# EAGLE design pic32 (EAGLE 7.5.0)
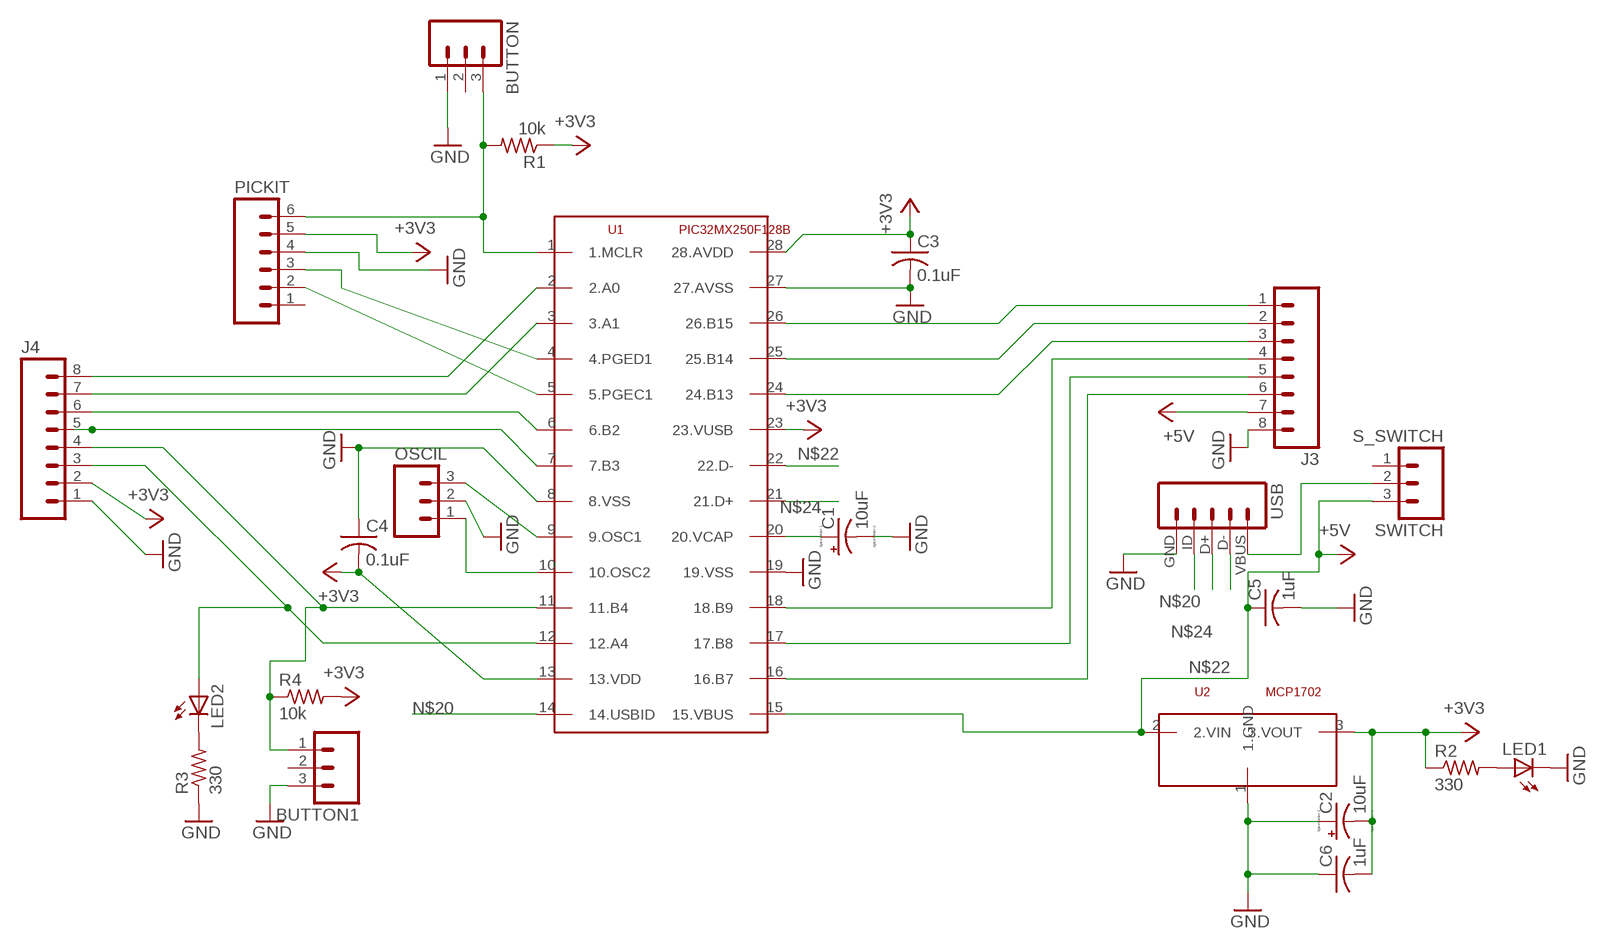
[diagram p0: schematic, sheet 1]

## Parts
BUTTON  M03PTH  [1X03]
BUTTON1  M03PTH  [1X03]
C1  10uF  CPOL-USTT2D4  [TT2D4]
C2  10uF  CPOL-USTT2D4  [TT2D4]
C3  0.1uF  C-US025-024X044  [C025-024X044]
C4  0.1uF  C-US025-024X044  [C025-024X044]
C5  1uF  C-US025-024X044  [C025-024X044]
C6  1uF  C-US025-024X044  [C025-024X044]
J3  M08  [1X08_ROUND]
J4  M08  [1X08_ROUND]
LED1  LED3MM  [LED3MM]
LED2  LED3MM  [LED3MM]
OSCIL  M03PTH  [1X03]
PICKIT  M06SILK_FEMALE_PTH  [1X06]
R1  10k  R-US_0207/7  [0207/7]
R2  330  R-US_0207/7  [0207/7]
R3  330  R-US_0207/7  [0207/7]
R4  10k  R-US_0207/7  [0207/7]
SWITCH  S_SWITCH  [S_SWITCH]
U1  PIC32MX250F128B  PIC32  [DIL28-3]
U2  MCP1702  [TO92]
USB  M05  [USB-MB-H]

## Nets
+3V3: C2.- C3.1 C4.2 C6.2 J4.2 PICKIT.5 R1.1 R2.1 R4.2 U1.13(13.VDD) U1.23(23.VUSB) U1.28(28.AVDD) U2.3(3.VOUT)
+5V: C5.1 J3.7 SWITCH.3 U1.15(15.VBUS) U2.2(2.VIN)
GND: BUTTON1.3 BUTTON.1 C1.- C2.+ C3.2 C4.1 C5.2 C6.1 J3.8 J4.1 LED1.K(C) OSCIL.2 PICKIT.4 R3.1 U1.8(8.VSS) U1.19(19.VSS) U1.27(27.AVSS) U2.1(1.GND) USB.GND
N$1: C1.+ U1.20(20.VCAP)
N$2: PICKIT.2 U1.5(5.PGEC1)
N$3: PICKIT.3 U1.4(4.PGED1)
N$4: BUTTON.3 PICKIT.6 R1.2 U1.1(1.MCLR)
N$5: J3.1 U1.26(26.B15)
N$6: J3.2 U1.25(25.B14)
N$7: J3.3 U1.24(24.B13)
N$8: J3.4 U1.18(18.B9)
N$9: J3.5 U1.17(17.B8)
N$10: J3.6 U1.16(16.B7)
N$11: J4.8 U1.2(2.A0)
N$12: J4.7 U1.3(3.A1)
N$13: J4.6 U1.6(6.B2)
N$14: BUTTON1.1 J4.4 R4.1 U1.11(11.B4)
N$16: J4.3 LED2.A U1.12(12.A4)
N$17: OSCIL.3 U1.9(9.OSC1)
N$18: J4.5 U1.7(7.B3)
N$19: OSCIL.1 U1.10(10.OSC2)
N$20: U1.14(14.USBID) USB.ID
N$21: SWITCH.2 USB.VBUS
N$22: U1.22(22.D-) USB.D-
N$23: LED1.A R2.2
N$24: U1.21(21.D+) USB.D+
N$26: LED2.K(C) R3.2
Unconnected: BUTTON1.2 BUTTON.2 PICKIT.1 SWITCH.1

## Library data of the parts
BUTTON BUTTON1 OSCIL = ME433:M03: Header 3 Standard 3-pin 0.1" header. Use with straight break away headers (SKU : PRT-00116), right angle break away headers (PRT-00553), swiss pins (PRT-00743), machine pins (PRT-00117), and female headers (PRT-00115). Molex polarized connector foot print use with SKU : PRT-08232 with associated crimp pins and housings.
C1 C2 = ME433:CPOL-US: POLARIZED CAPACITOR, American symbol
C3-C6 = ME433:C-US: CAPACITOR, American symbol
J3 J4 = ME433:M08: Header 8 Standard 8-pin 0.1" header. Use with straight break away headers (SKU : PRT-00116), right angle break away headers (PRT-00553), swiss pins (PRT-00743), machine pins (PRT-00117), and female headers (PRT-00115).; PROD_ID: CONN-08437
LED1 = led:LED: LED OSRAM: - CHIPLED LG R971, LG N971, LY N971, LG Q971, LY Q971, LO R971, LY R971 LH N974, LH R974 LS Q976, LO Q976, LY Q976 LO Q996 - Hyper CHIPLED LW Q18S LB Q993, LB Q99A, LB R99A - SideLED LS A670, LO A670, LY A670, LG A670, LP A670 LB A673, LV A673, LT A673, LW A673 LH A674 LY A675 LS A676, LA A676, LO A676, LY A676, LW A676 LS A679, LY A679, LG A679 - Hyper Micro SIDELED® LS Y876, LA Y876, LO Y876, LY Y876 LT Y87S - SmartLED LW L88C, LW L88S LB L89C, LB L89S, LG L890 LS L89K, LO L89K, LY L89K LS L896, LA L896, LO L896, LY L896 - TOPLED LS T670, LO T670, LY T670, LG T670, LP T670 LSG T670, LSP T670, LSY T670, LOP T670, LYG T670 LG T671, LOG T671, LSG T671 LB T673, LV T673, LT T673, LW T673 LH T674 LS T676, LA T676, LO T676, LY T676, LB T676, LH T676, LSB T676, LW T676 LB T67C, LV T67C, LT T67C, LS T67K, LO T67K, LY T67K, LW E67C LS E67B, LA E67B, LO E67B, LY E67B, LB E67C, LV E67C, LT E67C LW T67C LS T679, LY T679, LG T679 LS T770, LO T770, LY T770, LG T770, LP T770 LB T773, LV T773, LT T773, LW T773 LH T774 LS E675, LA E675, LY E675, LS T675 LS T776, LA T776, LO T776, LY T776, LB T776 LHGB T686 LT T68C, LB T68C - Hyper Mini TOPLED® LB M676 - Mini TOPLED Santana® LG M470 LS M47K, LO M47K, LY M47K Source: http://www.osram.convergy.de LUXEON: - LUMILED® LXK2-PW12-R00, LXK2-PW12-S00, LXK2-PW14-U00, LXK2-PW14-V00 LXK2-PM12-R00, LXK2-PM12-S00, LXK2-PM14-U00 LXK2-PE12-Q00, LXK2-PE12-R00, LXK2-PE12-S00, LXK2-PE14-T00, LXK2-PE14-U00 LXK2-PB12-K00, LXK2-PB12-L00, LXK2-PB12-M00, LXK2-PB14-N00, LXK2-PB14-P00, LXK2-PB14-Q00 LXK2-PR12-L00, LXK2-PR12-M00, LXK2-PR14-Q00, LXK2-PR14-R00 LXK2-PD12-Q00, LXK2-PD12-R00, LXK2-PD12-S00 LXK2-PH12-R00, LXK2-PH12-S00 LXK2-PL12-P00, LXK2-PL12-Q00, LXK2-PL12-R00 Source: www.luxeon.com KINGBRIGHT: KA-3528ASYC Source: www.kingbright.com
LED2 = ME433:LED: LED OSRAM: - CHIPLED LG R971, LG N971, LY N971, LG Q971, LY Q971, LO R971, LY R971 LH N974, LH R974 LS Q976, LO Q976, LY Q976 LO Q996 - Hyper CHIPLED LW Q18S LB Q993, LB Q99A, LB R99A - SideLED LS A670, LO A670, LY A670, LG A670, LP A670 LB A673, LV A673, LT A673, LW A673 LH A674 LY A675 LS A676, LA A676, LO A676, LY A676, LW A676 LS A679, LY A679, LG A679 - Hyper Micro SIDELED® LS Y876, LA Y876, LO Y876, LY Y876 LT Y87S - SmartLED LW L88C, LW L88S LB L89C, LB L89S, LG L890 LS L89K, LO L89K, LY L89K LS L896, LA L896, LO L896, LY L896 - TOPLED LS T670, LO T670, LY T670, LG T670, LP T670 LSG T670, LSP T670, LSY T670, LOP T670, LYG T670 LG T671, LOG T671, LSG T671 LB T673, LV T673, LT T673, LW T673 LH T674 LS T676, LA T676, LO T676, LY T676, LB T676, LH T676, LSB T676, LW T676 LB T67C, LV T67C, LT T67C, LS T67K, LO T67K, LY T67K, LW E67C LS E67B, LA E67B, LO E67B, LY E67B, LB E67C, LV E67C, LT E67C LW T67C LS T679, LY T679, LG T679 LS T770, LO T770, LY T770, LG T770, LP T770 LB T773, LV T773, LT T773, LW T773 LH T774 LS E675, LA E675, LY E675, LS T675 LS T776, LA T776, LO T776, LY T776, LB T776 LHGB T686 LT T68C, LB T68C - Hyper Mini TOPLED® LB M676 - Mini TOPLED Santana® LG M470 LS M47K, LO M47K, LY M47K Source: http://www.osram.convergy.de LUXEON: - LUMILED® LXK2-PW12-R00, LXK2-PW12-S00, LXK2-PW14-U00, LXK2-PW14-V00 LXK2-PM12-R00, LXK2-PM12-S00, LXK2-PM14-U00 LXK2-PE12-Q00, LXK2-PE12-R00, LXK2-PE12-S00, LXK2-PE14-T00, LXK2-PE14-U00 LXK2-PB12-K00, LXK2-PB12-L00, LXK2-PB12-M00, LXK2-PB14-N00, LXK2-PB14-P00, LXK2-PB14-Q00 LXK2-PR12-L00, LXK2-PR12-M00, LXK2-PR14-Q00, LXK2-PR14-R00 LXK2-PD12-Q00, LXK2-PD12-R00, LXK2-PD12-S00 LXK2-PH12-R00, LXK2-PH12-S00 LXK2-PL12-P00, LXK2-PL12-Q00, LXK2-PL12-R00 Source: www.luxeon.com KINGBRIGHT: KA-3528ASYC Source: www.kingbright.com
PICKIT = ME433:M06: Header 6 Standard 6-pin 0.1" header. Use with straight break away headers (SKU : PRT-00116), right angle break away headers (PRT-00553), swiss pins (PRT-00743), machine pins (PRT-00117), and female headers (PRT-00115). Molex polarized connector foot print use with SKU : PRT-08094 with associated crimp pins and housings. NOTES ON THE VARIANTS LOCK and LOCK_LONGPADS... This footprint was designed to help hold the alignment of a through-hole component (i.e. 6-pin header) while soldering it into place. You may notice that each hole has been shifted either up or down by 0.005 of an inch from it's more standard position (which is a perfectly straight line). This slight alteration caused the pins (the squares in the middle) to touch the edges of the holes. Because they are alternating, it causes a "brace" to hold the component in place. 0.005 has proven to be the perfect amount of "off-center" position when using our standard breakaway headers. Although looks a little odd when you look at the bare footprint, once you have a header in there, the alteration is very hard to notice. Also,if you push a header all the way into place, it is covered up entirely on the bottom side. This idea of altering the position of holes to aid alignment will be further integrated into the Sparkfun Library for other footprints. It can help hold any component with 3 or more connection pins.; PROD_ID: CONN-08437
R1 = resistor:R-US_: RESISTOR, American symbol
R2-R4 = ME433:R-US_: RESISTOR, American symbol
SWITCH = ME433:S_SWITCH
U1 = ME433:PIC32
U2 = ME433:MCP1702
USB = ME433:M05: Header 5 Standard 5-pin 0.1" header. Use with straight break away headers (SKU : PRT-00116), right angle break away headers (PRT-00553), swiss pins (PRT-00743), machine pins (PRT-00117), and female headers (PRT-00115). Molex polarized connector foot print use with SKU : PRT-08230 with associated crimp pins and housings.

## Net classes
0 default: drill 0.381 mm

## Board
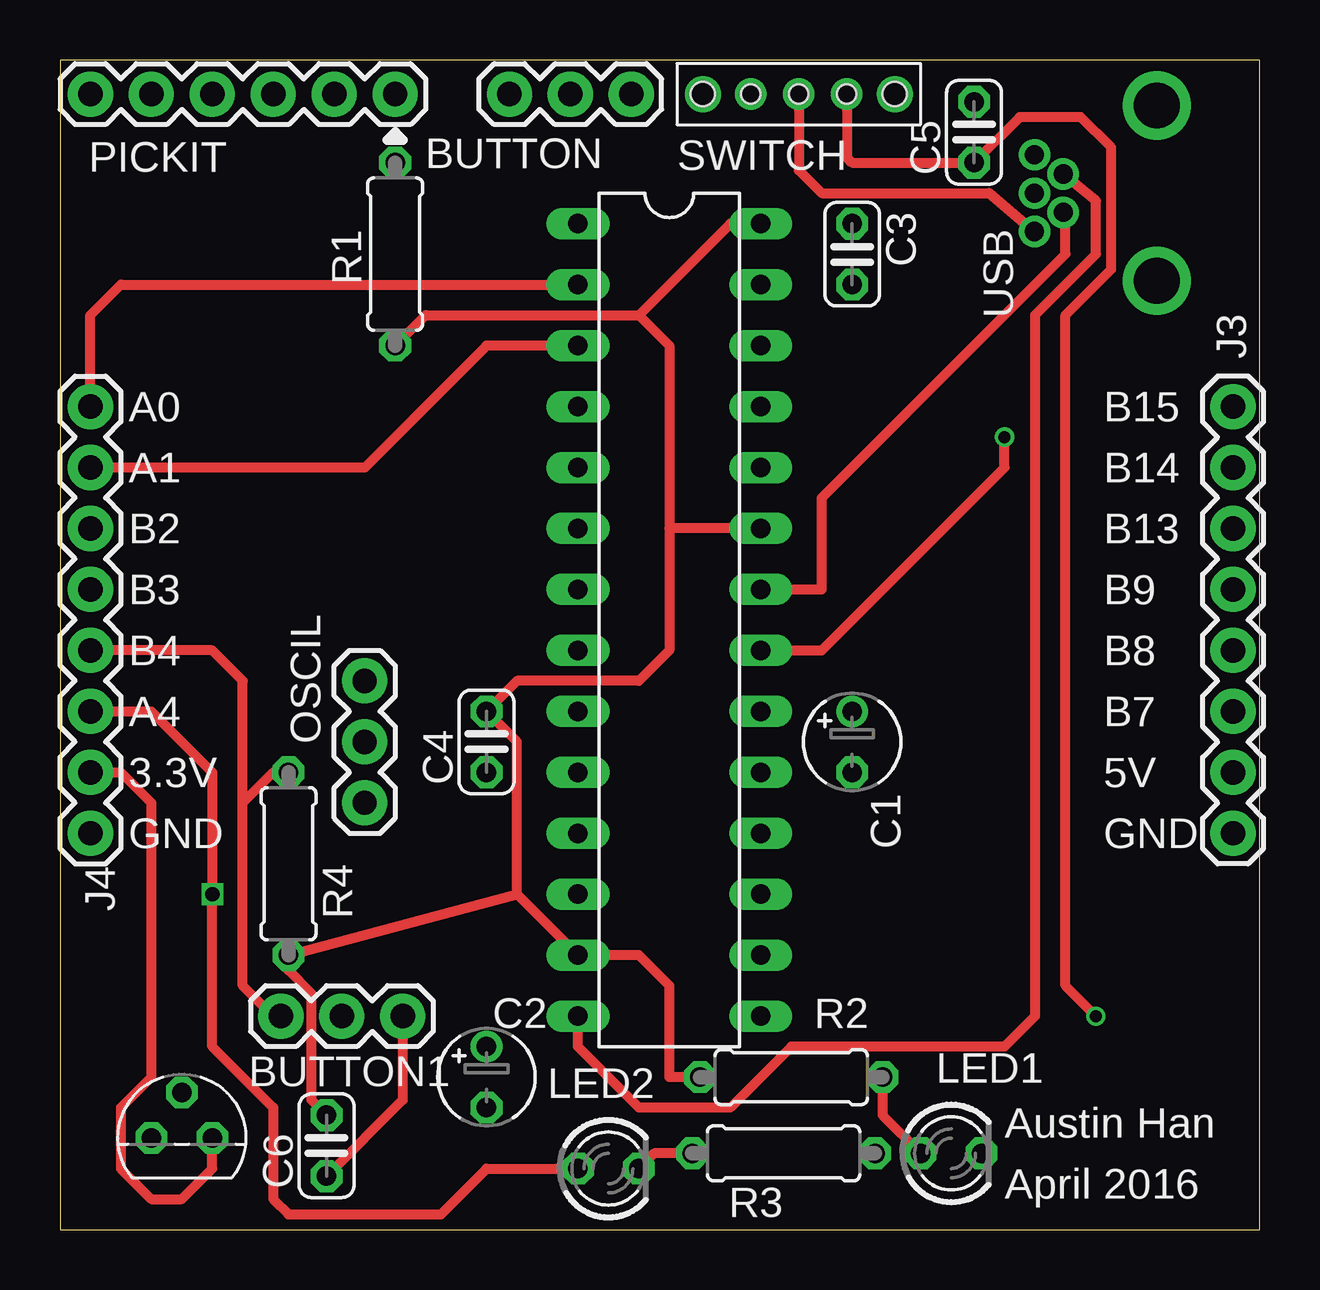
[diagram p1: board, top side]
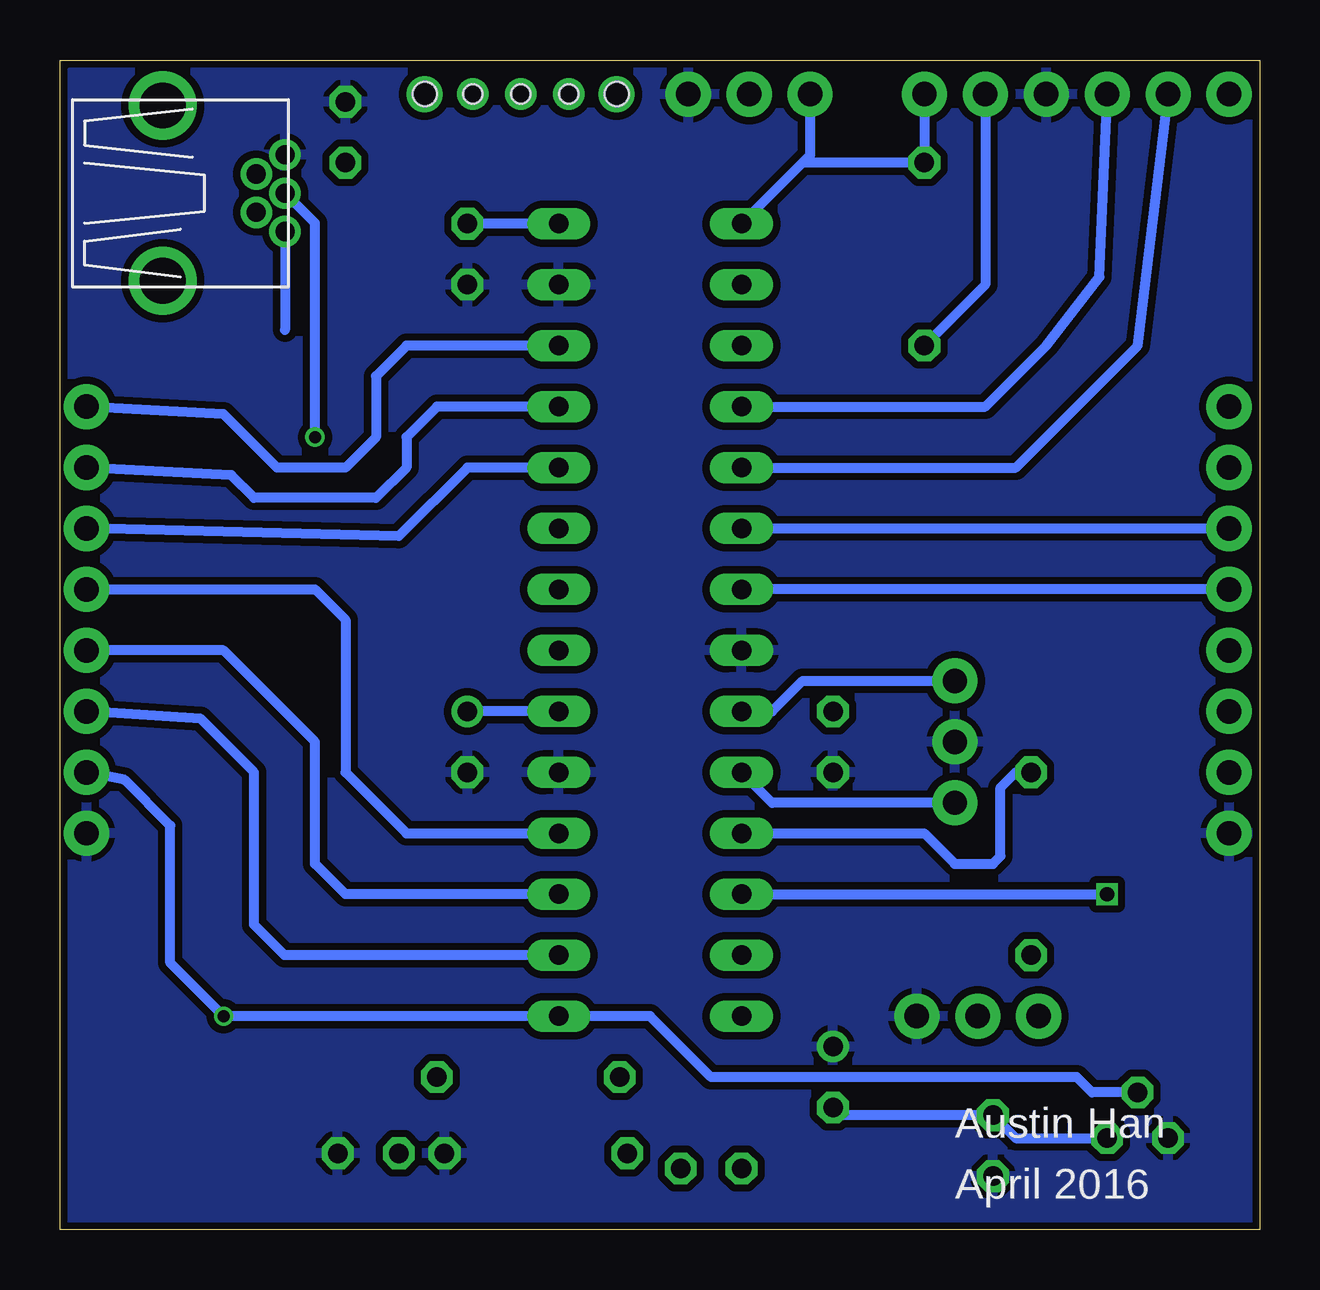
[diagram p2: board, bottom side, seen from below]

Size 50 x 48.73 mm. Coordinates in mm from the lower left corner, seen from the top.
Outline: 0,0 50,0 50,48.73 0,48.73 0,0
Copper layers (1*16): Top 0.035mm / dielectric 1.5mm / Bottom 0.035mm
Design rules "SeeedStudio_2layer_DRU_no_angle_20140221": minimum track width 6mil, minimum drill 12mil, track to track 6mil, track to pad 6mil, pad to pad 6mil, via to via 6mil, smd to smd 0mil, copper to edge 10mil, drill to drill 10mil, minimum pad ring 10mil, minimum via ring 6mil, stop-mask expansion 2mil, vias tented up to drill 100mil, thermal gap 10mil

### Footprints (pad centres in the part's own frame; a part is rotated, then mirrored left to right if it is on the bottom)
1X03 = drill 1.016 pad 1.88: 1 0,0; 2 2.54,0; 3 5.08,0
TT2D4 = drill 0.813: + -1.27,0 | drill 0.813 octagon: - 1.27,0
C025-024X044 = drill 0.813 octagon: 1 -1.27,0; 2 1.27,0
1X08_ROUND = drill 1.016 pad 1.88: 1 0,0; 2 2.54,0; 3 5.08,0; 4 7.62,0; 5 10.16,0; 6 12.7,0; 7 15.24,0; 8 17.78,0
LED3MM = drill 0.813 octagon: A -1.27,0; K 1.27,0
1X06 = drill 1.016 pad 1.88: 1 0,0; 2 2.54,0; 3 5.08,0; 4 7.62,0; 5 10.16,0; 6 12.7,0
0207/7 = drill 0.813 octagon: 1 -3.81,0; 2 3.81,0
S_SWITCH = drill 0.8: 1 -2,0; 2 0,0; 3 2,0 | drill 1: P$4 -4,0; P$5 4,0 | hole 0.8: -2,0; 0,0; 2,0 | hole 1: -4,0; 4,0
DIL28-3 = drill 0.813 long: 1 -16.51,-3.81; 2 -13.97,-3.81; 3 -11.43,-3.81; 4 -8.89,-3.81; 5 -6.35,-3.81; 6 -3.81,-3.81; 7 -1.27,-3.81; 8 1.27,-3.81; 9 3.81,-3.81; 10 6.35,-3.81; 11 8.89,-3.81; 12 11.43,-3.81; 13 13.97,-3.81; 14 16.51,-3.81; 15 16.51,3.81; 16 13.97,3.81; 17 11.43,3.81; 18 8.89,3.81; 19 6.35,3.81; 20 3.81,3.81; 21 1.27,3.81; 22 -1.27,3.81; 23 -3.81,3.81; 24 -6.35,3.81; 25 -8.89,3.81; 26 -11.43,3.81; 27 -13.97,3.81; 28 -16.51,3.81
TO92 = drill 0.813 octagon: 1 -1.27,0; 2 0,1.905; 3 1.27,0
USB-MB-H = drill 0.8: D+ 5.1,0; D- 3.9,0.8; GND 5.1,-1.6; ID 3.9,-0.8; VBUS 5.1,1.6 | drill 1.9: P$6 0,-3.65; P$7 0,3.65

### Placement (x,y rotation side)
BUTTON  23.81,47.31 180 top
BUTTON1  9.21,8.89 0 top
C1  33.02,20.32 270 top
C2  17.78,6.35 270 top
C3  33.02,40.64 270 top
C4  17.78,20.32 90 top
C5  38.1,45.72 90 top
C6  11.11,3.49 90 top
J3  48.9,34.29 270 top
J4  1.27,16.51 90 top
LED1  37.15,3.17 0 top
LED2  22.86,2.54 0 top
OSCIL  12.7,17.78 90 top
PICKIT  1.27,47.31 0 top
R1  13.97,40.64 90 top
R2  30.48,6.35 0 top
R3  30.16,3.17 180 top
R4  9.53,15.24 270 top
SWITCH  30.8,47.31 0 top
U1  25.4,25.4 270 top
U2  5.08,3.81 0 top
USB  45.72,43.18 180 top

### Tracks (layer width: path | path; a pad name or v marks a point on that pad's centre or on a via)
+3V3
  Top 0.406: U2.3 6.35,2.54 5.08,1.27 3.81,1.27 2.54,2.54 2.54,5.08 3.81,6.35 3.81,17.78 2.54,19.05 J4.2 | R2.1 25.4,6.35 25.4,10.16 24.13,11.43 U1.13 19.05,13.97 | 19.05,13.97 19.05,20.32 C4.2 19.05,22.86 24.13,22.86 25.4,24.13 25.4,29.21 | R1.1 15.24,38.1 24.13,38.1 | 24.13,38.1 25.4,36.83 25.4,29.21 | U1.23 25.4,29.21 | 24.13,38.1 27.94,41.91 U1.28 | 19.05,13.97 R4.2 9.53,10.79 10.48,9.84 10.48,5.4 C6.2
  Bottom 0.406: U1.28 C3.1 | PICKIT.5 11.43,39.37 R1.1 | C2.- 17.46,4.76 C6.2 10.16,3.81 U2.3
+5V  (via drill 0.5)
  Top 0.406: v43.18,8.89 41.91,10.16 41.91,38.1 43.81,40.01 43.81,45.09 42.55,46.35 40.01,46.35 C5.1 33.02,44.45 32.8,44.67 SWITCH.3
  Bottom 0.406: U2.2 6.99,5.71 7.62,6.35 22.86,6.35 25.4,8.89 U1.15 v43.18,8.89 45.4,11.11 45.4,16.83 47.31,18.73 J3.7
GND
  Top 0.406: BUTTON1.3 14.29,5.4 C6.1
  pour Bottom (isolate 0.305): 0,48.26 0,0 49.53,0 49.53,48.26
N$1
  Bottom 0.406: U1.20 C1.+
N$2
  Bottom 0.406: U1.5 10.16,31.75 5.08,36.83 PICKIT.2
N$3
  Bottom 0.406: U1.4 11.43,34.29 8.89,36.83 6.67,39.69 PICKIT.3
N$4
  Bottom 0.406: 19.05,44.45 R1.2 PICKIT.6 | 19.05,44.45 U1.1 | BUTTON.3 18.73,44.77 19.05,44.45
N$5
  Bottom 0.406: U1.26 35.56,36.83 36.83,35.56 36.83,33.02 38.1,31.75 40.96,31.75 43.18,33.97 J3.1
N$6
  Bottom 0.406: U1.25 34.29,34.29 35.56,33.02 35.56,31.75 36.83,30.48 41.91,30.48 42.86,31.43 J3.2
N$7
  Bottom 0.406: U1.24 33.02,31.75 35.88,28.89 J3.3
N$8
  Bottom 0.406: J3.4 39.37,26.67 38.1,25.4 38.1,19.05 35.56,16.51 U1.18
N$9
  Bottom 0.406: U1.17 38.1,13.97 39.37,15.24 39.37,20.32 43.18,24.13 J3.5
N$10
  Bottom 0.406: U1.16 40.64,11.43 41.91,12.7 41.91,19.05 44.13,21.27 J3.6
N$11
  Top 0.406: J4.8 1.27,38.1 2.54,39.37 U1.2
N$12
  Top 0.406: U1.3 17.78,36.83 12.7,31.75 J4.7
N$13
  Bottom 0.406: U1.6 J4.6
N$14
  Top 0.406: BUTTON1.1 8.89,8.89 7.62,10.16 7.62,17.78 | 7.62,17.78 8.89,19.05 R4.1 | 7.62,17.78 7.62,22.86 6.35,24.13 J4.4
  Bottom 0.406: U1.11 13.97,16.51 12.7,15.24 11.11,15.24 10.79,15.56 10.79,18.41 10.16,19.05 R4.1
N$16  (via drill 0.6)
  Top 0.406: J4.3 3.81,21.59 6.35,19.05 v6.35,13.97 6.35,7.62 8.89,5.08 8.89,1.27 9.53,0.64 15.88,0.64 17.78,2.54 LED2.A
  Bottom 0.406: U1.12 v6.35,13.97
N$17
  Bottom 0.406: U1.9 20.32,21.59 19.05,22.86 OSCIL.3
N$18
  Bottom 0.406: J4.5 U1.7
N$19
  Bottom 0.406: OSCIL.1 20.32,17.78 U1.10
N$20
  Top 0.406: U1.14 21.59,7.62 24.13,5.08 27.94,5.08 30.48,7.62 39.37,7.62 40.64,8.89 40.64,38.1 43.18,40.64 43.18,42.86 USB.ID
N$21
  Top 0.406: SWITCH.2 30.8,44.13 31.75,43.18 38.73,43.18 USB.VBUS
  Bottom 0.406: USB.VBUS 40.62,37.48
N$22
  Top 0.406: U1.22 31.75,26.67 31.75,30.48 41.91,40.64 41.91,42.29 USB.D-
N$23
  Top 0.406: R2.2 34.29,4.76 LED1.A
N$24  (via drill 0.5)
  Top 0.406: U1.21 31.75,24.13 39.37,31.75 v39.37,33.02
  Bottom 0.406: v39.37,33.02 39.37,41.93 USB.D+
N$26
  Top 0.406: R3.2 24.77,3.17 LED2.K

### Text on the board
tPlace: Austin Han | April 2016
bPlace: Austin Han | April 2016
tNames: A0 | B15 | A1 | B14 | B2 | B13 | B3 | B9 | B4 | B8 | A4 | B7 | 3.3V | 5V | GND | GND